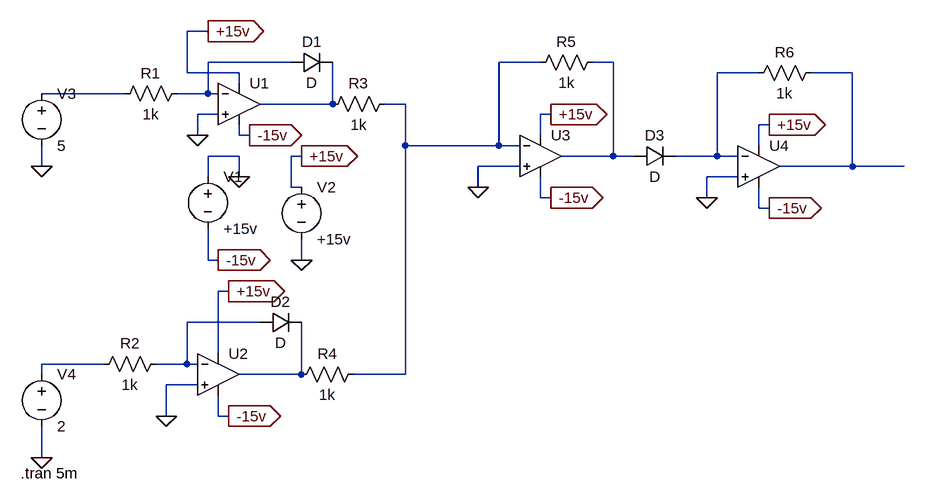
[diagram p0: schematic Multiplication by OpAmp.asc]
Multiplication by OpAmp.asc, the LTspice schematic file:
Version 4.1
SHEET 1 1172 696
WIRE 16 0 -16 0
WIRE 144 48 16 48
WIRE 528 48 464 48
WIRE 640 48 608 48
WIRE -16 64 -16 0
WIRE 64 64 -16 64
WIRE 864 64 800 64
WIRE 1008 64 944 64
WIRE 64 80 64 64
WIRE -112 96 -240 96
WIRE 16 96 16 48
WIRE 16 96 -32 96
WIRE 32 96 16 96
WIRE 208 112 208 48
WIRE 208 112 96 112
WIRE 320 112 288 112
WIRE 32 128 0 128
WIRE 544 128 528 128
WIRE 880 144 864 144
WIRE 0 160 0 128
WIRE 64 160 64 144
WIRE 80 160 64 160
WIRE 528 160 528 128
WIRE 320 176 320 112
WIRE 464 176 464 48
WIRE 464 176 320 176
WIRE 496 176 464 176
WIRE 864 176 864 144
WIRE 64 192 16 192
WIRE 160 192 144 192
WIRE 640 192 640 48
WIRE 640 192 560 192
WIRE 672 192 640 192
WIRE 800 192 800 64
WIRE 800 192 736 192
WIRE 832 192 800 192
WIRE -240 208 -240 176
WIRE 496 208 432 208
WIRE 1008 208 1008 64
WIRE 1008 208 896 208
WIRE 1088 208 1008 208
WIRE 16 224 16 192
WIRE 64 224 64 192
WIRE 832 224 784 224
WIRE 144 240 144 192
WIRE 160 240 144 240
WIRE 432 240 432 208
WIRE 528 256 528 224
WIRE 544 256 528 256
WIRE 784 256 784 224
WIRE 864 272 864 240
WIRE 880 272 864 272
WIRE 16 352 16 304
WIRE 32 352 16 352
WIRE 160 352 160 320
WIRE 48 400 32 400
WIRE 96 448 -16 448
WIRE 32 496 32 400
WIRE -144 512 -240 512
WIRE -16 512 -16 448
WIRE -16 512 -64 512
WIRE 0 512 -16 512
WIRE -240 528 -240 512
WIRE 160 528 160 448
WIRE 160 528 64 528
WIRE 320 528 320 176
WIRE 320 528 240 528
WIRE 0 544 -48 544
WIRE -48 592 -48 544
WIRE 32 592 32 560
WIRE 48 592 32 592
WIRE -240 656 -240 608
FLAG -48 592 0
FLAG 0 160 0
FLAG 432 240 0
FLAG 784 256 0
FLAG 160 352 0
FLAG -240 656 0
FLAG -240 208 0
FLAG 16 0 +15v
IOPIN 16 0 Out
FLAG 160 192 +15v
IOPIN 160 192 Out
FLAG 64 224 0
FLAG 32 352 -15v
IOPIN 32 352 Out
FLAG 80 160 -15v
IOPIN 80 160 Out
FLAG 48 592 -15v
IOPIN 48 592 Out
FLAG 544 256 -15v
IOPIN 544 256 Out
FLAG 880 272 -15v
IOPIN 880 272 Out
FLAG 544 128 +15v
IOPIN 544 128 Out
FLAG 880 144 +15v
IOPIN 880 144 Out
FLAG 48 400 +15v
IOPIN 48 400 Out
SYMBOL OpAmps\\UniversalOpAmp2 64 112 R0
SYMATTR InstName U1
SYMBOL OpAmps\\UniversalOpAmp2 32 528 R0
SYMATTR InstName U2
SYMBOL OpAmps\\UniversalOpAmp2 528 192 R0
SYMATTR InstName U3
SYMBOL OpAmps\\UniversalOpAmp2 864 208 R0
SYMATTR InstName U4
SYMBOL res -16 80 R90
WINDOW 0 0 56 VBottom 2
WINDOW 3 32 56 VTop 2
SYMATTR InstName R1
SYMATTR Value 1k
SYMBOL res -48 496 R90
WINDOW 0 0 56 VBottom 2
WINDOW 3 32 56 VTop 2
SYMATTR InstName R2
SYMATTR Value 1k
SYMBOL res 304 96 R90
WINDOW 0 0 56 VBottom 2
WINDOW 3 32 56 VTop 2
SYMATTR InstName R3
SYMATTR Value 1k
SYMBOL res 256 512 R90
WINDOW 0 0 56 VBottom 2
WINDOW 3 32 56 VTop 2
SYMATTR InstName R4
SYMATTR Value 1k
SYMBOL diode 144 64 R270
WINDOW 0 32 32 VTop 2
WINDOW 3 0 32 VBottom 2
SYMATTR InstName D1
SYMBOL diode 96 464 R270
WINDOW 0 32 32 VTop 2
WINDOW 3 0 32 VBottom 2
SYMATTR InstName D2
SYMBOL voltage 16 208 R0
SYMATTR InstName V1
SYMATTR Value +15v
SYMBOL voltage 160 224 R0
SYMATTR InstName V2
SYMATTR Value +15v
SYMBOL voltage -240 80 R0
WINDOW 123 0 0 Left 0
WINDOW 39 0 0 Left 0
SYMATTR InstName V3
SYMATTR Value 5
SYMBOL voltage -240 512 R0
SYMATTR InstName V4
SYMATTR Value 2
SYMBOL res 624 32 R90
WINDOW 0 0 56 VBottom 2
WINDOW 3 32 56 VTop 2
SYMATTR InstName R5
SYMATTR Value 1k
SYMBOL res 960 48 R90
WINDOW 0 0 56 VBottom 2
WINDOW 3 32 56 VTop 2
SYMATTR InstName R6
SYMATTR Value 1k
SYMBOL diode 672 208 R270
WINDOW 0 32 32 VTop 2
WINDOW 3 0 32 VBottom 2
SYMATTR InstName D3
TEXT -272 680 Left 2 !.tran 5m

The netlist it stands for:
* Multiplication by OpAmp.asc
X§U1 0 N001 +15v -15v N007 level2 Avol=1Meg GBW=10Meg Slew=10Meg Ilimit=25m Rail=0 Vos=0 En=0 Enk=0 In=0 Ink=0 Rin=500Meg  ; pins In+ In- V+ V- OUT
X§U2 0 N008 +15v -15v N010 level2 Avol=1Meg GBW=10Meg Slew=10Meg Ilimit=25m Rail=0 Vos=0 En=0 Enk=0 In=0 Ink=0 Rin=500Meg  ; pins In+ In- V+ V- OUT
X§U3 0 N002 +15v -15v N003 level2 Avol=1Meg GBW=10Meg Slew=10Meg Ilimit=25m Rail=0 Vos=0 En=0 Enk=0 In=0 Ink=0 Rin=500Meg  ; pins In+ In- V+ V- OUT
X§U4 0 N004 +15v -15v N005 level2 Avol=1Meg GBW=10Meg Slew=10Meg Ilimit=25m Rail=0 Vos=0 En=0 Enk=0 In=0 Ink=0 Rin=500Meg  ; pins In+ In- V+ V- OUT
R1 N001 N006 1k
R2 N008 N009 1k
R3 N002 N007 1k
R4 N002 N010 1k
D1 N001 N007 D
D2 N008 N010 D
V1 0 -15v +15v
V2 +15v 0 +15v
V3 N006 0 5
V4 N009 0 2
R5 N003 N002 1k
R6 N005 N004 1k
D3 N003 N004 D
.model D D
.lib standard.dio
.tran 5m
.lib UniversalOpAmp2.lib
.backanno
.end